# Altium project FPGA_board_controller.PrjPcb (part 1 of 2)
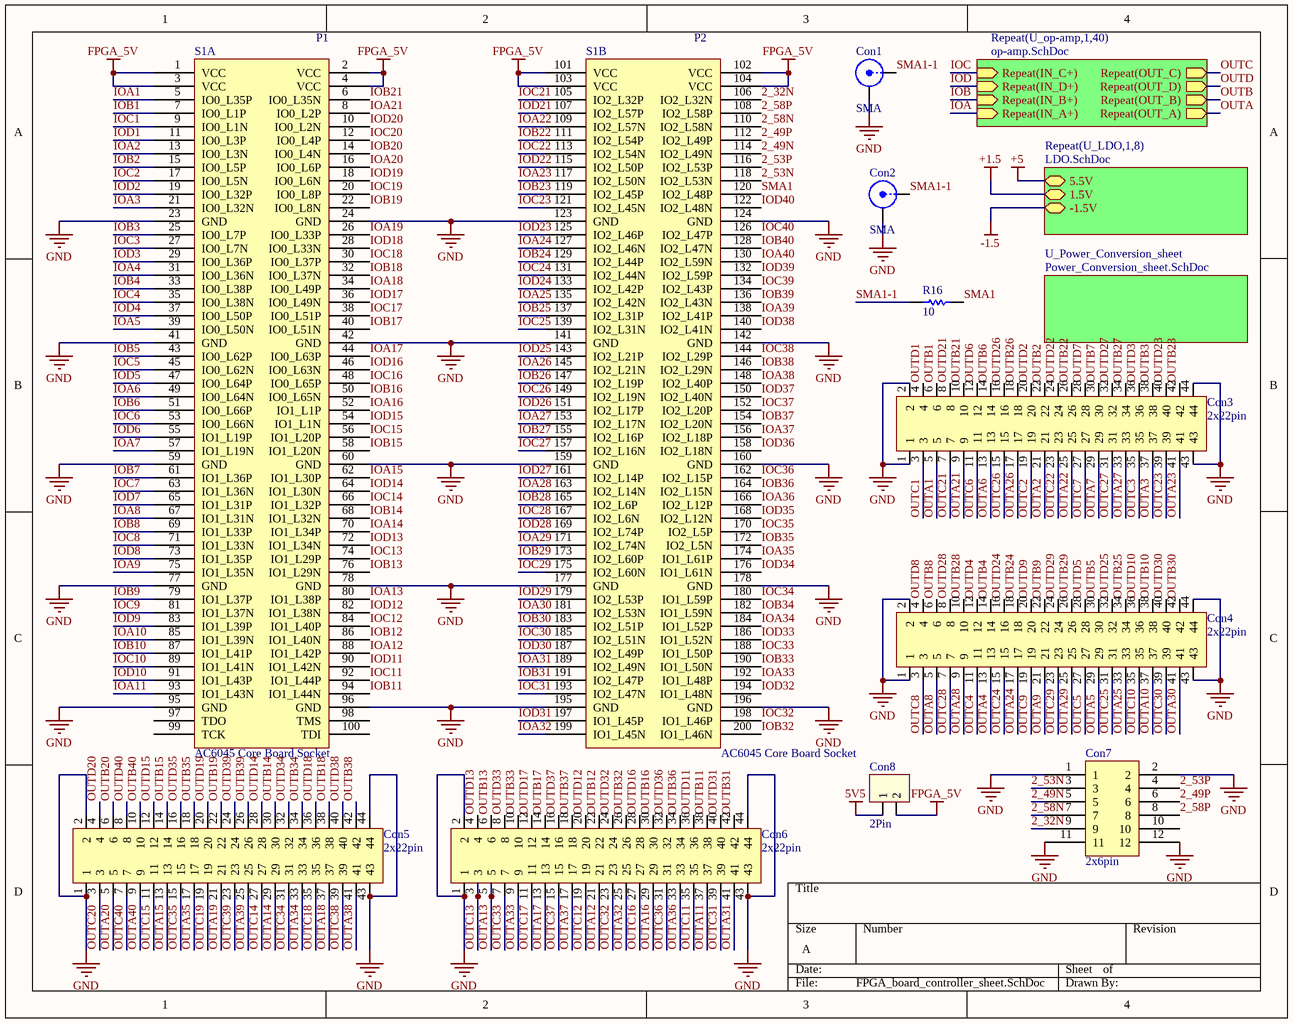
[diagram p0: FPGA_board_controller_sheet.SchDoc]
4 sheets, 507 parts. Net scope: hierarchical (ports join the sheet entries above them; power ports are global).
Board file: PCB1.PcbDoc
Sheets:
  FPGA_board_controller_sheet.SchDoc
    U_Power_Conversion_sheet = Power_Conversion_sheet.SchDoc
    U_LDO1 = LDO.SchDoc
    U_LDO2 = LDO.SchDoc
    U_LDO3 = LDO.SchDoc
    U_LDO4 = LDO.SchDoc
    U_LDO5 = LDO.SchDoc
    U_LDO6 = LDO.SchDoc
    U_LDO7 = LDO.SchDoc
    U_LDO8 = LDO.SchDoc
    U_op-amp1 = op-amp.SchDoc
    U_op-amp2 = op-amp.SchDoc
    U_op-amp3 = op-amp.SchDoc
    U_op-amp4 = op-amp.SchDoc
    U_op-amp5 = op-amp.SchDoc
    U_op-amp6 = op-amp.SchDoc
    U_op-amp7 = op-amp.SchDoc
    U_op-amp8 = op-amp.SchDoc
    U_op-amp9 = op-amp.SchDoc
    U_op-amp10 = op-amp.SchDoc
    U_op-amp11 = op-amp.SchDoc
    U_op-amp12 = op-amp.SchDoc
    U_op-amp13 = op-amp.SchDoc
    U_op-amp14 = op-amp.SchDoc
    U_op-amp15 = op-amp.SchDoc
    U_op-amp16 = op-amp.SchDoc
    U_op-amp17 = op-amp.SchDoc
    U_op-amp18 = op-amp.SchDoc
    U_op-amp19 = op-amp.SchDoc
    U_op-amp20 = op-amp.SchDoc
    U_op-amp21 = op-amp.SchDoc
    U_op-amp22 = op-amp.SchDoc
    U_op-amp23 = op-amp.SchDoc
    U_op-amp24 = op-amp.SchDoc
    U_op-amp25 = op-amp.SchDoc
    U_op-amp26 = op-amp.SchDoc
    U_op-amp27 = op-amp.SchDoc
    U_op-amp28 = op-amp.SchDoc
    U_op-amp29 = op-amp.SchDoc
    U_op-amp30 = op-amp.SchDoc
    U_op-amp31 = op-amp.SchDoc
    U_op-amp32 = op-amp.SchDoc
    U_op-amp33 = op-amp.SchDoc
    U_op-amp34 = op-amp.SchDoc
    U_op-amp35 = op-amp.SchDoc
    U_op-amp36 = op-amp.SchDoc
    U_op-amp37 = op-amp.SchDoc
    U_op-amp38 = op-amp.SchDoc
    U_op-amp39 = op-amp.SchDoc
    U_op-amp40 = op-amp.SchDoc

## Sheet FPGA_board_controller_sheet.SchDoc
size A; SheetNumber: 1; SheetTotal: 4

### Parts
Con1  SMA  [SMA (3.5mm)]
Con2  SMA  [SMA (3.5mm)]
Con3  2x22pin  [2mm_2x22pin]
Con4  2x22pin  [2mm_2x22pin]
Con5  2x22pin  [2mm_2x22pin]
Con6  2x22pin  [2mm_2x22pin]
Con7  2x6pin  [2MM_2*6PIN]
Con8  2Pin  [XH2.54-2pin]
R16  10  [R0603]
S1  AC6045 Core Board Socket  [Core Board Socket]  (parts A,B of 2)

### Sub-sheets
Repeat(U_LDO,1,8) = LDO.SchDoc: 5.5V (bidir), 1.5V (bidir), -1.5V (bidir)
Repeat(U_op-amp,1,40) = op-amp.SchDoc: Repeat(IN_C+) (in), Repeat(OUT_C) (out), Repeat(OUT_D) (out), Repeat(IN_D+) (in), Repeat(OUT_B) (out), Repeat(IN_B+) (in), Repeat(OUT_A) (out), Repeat(IN_A+) (in)
U_Power_Conversion_sheet = Power_Conversion_sheet.SchDoc: no entries

### Nets
5V5: Con8.1
FPGA_5V: Con8.2 S1.1(VCC) S1.2(VCC) S1.3(VCC) S1.4(VCC) S1.101(VCC) S1.102(VCC) S1.103(VCC) S1.104(VCC)
GND: Con1.2(Y) Con2.2(Y) Con3.1 Con3.2 Con3.43 Con3.44 Con4.1 Con4.2 Con4.43 Con4.44 Con5.1 Con5.2 Con5.43 Con5.44 Con6.1 Con6.2 Con6.43 Con6.44 Con7.1 Con7.2 Con7.11 Con7.12 S1.23(GND) S1.24(GND) S1.41(GND) S1.42(GND) S1.59(GND) S1.60(GND) S1.77(GND) S1.78(GND) S1.95(GND) S1.96(GND) S1.123(GND) S1.124(GND) S1.141(GND) S1.142(GND) S1.159(GND) S1.160(GND) S1.177(GND) S1.178(GND) S1.195(GND) S1.196(GND)
2_32N: Con7.9 S1.106(IO2_L32N)
2_49N: Con7.5 S1.114(IO2_L49N)
2_49P: Con7.6 S1.112(IO2_L49P)
2_53N: Con7.3 S1.118(IO2_L53N)
2_53P: Con7.4 S1.116(IO2_L53P)
2_58N: Con7.7 S1.110(IO2_L58N)
2_58P: Con7.8 S1.108(IO2_L58P)
IOA: sheet Repeat(U_op-amp,1,40)/Repeat(IN_A+)
IOA1: S1.5(IO0_L35P)
IOA2: S1.13(IO0_L3N)
IOA3: S1.21(IO0_L32N)
IOA4: S1.31(IO0_L36N)
IOA5: S1.39(IO0_L50N)
IOA6: S1.49(IO0_L64N)
IOA7: S1.57(IO1_L19N)
IOA8: S1.67(IO1_L31N)
IOA9: S1.75(IO1_L35N)
IOA10: S1.85(IO1_L39N)
IOA11: S1.93(IO1_L43N)
IOA12: S1.88(IO1_L42P)
IOA13: S1.80(IO1_L38P)
IOA14: S1.70(IO1_L34P)
IOA15: S1.62(IO1_L30P)
IOA16: S1.52(IO1_L1P)
IOA17: S1.44(IO0_L63P)
IOA18: S1.34(IO0_L49P)
IOA19: S1.26(IO0_L33P)
IOA20: S1.16(IO0_L6P)
IOA21: S1.8(IO0_L2P)
IOA22: S1.109(IO2_L57N)
IOA23: S1.117(IO2_L50N)
IOA24: S1.127(IO2_L46N)
IOA25: S1.135(IO2_L42N)
IOA26: S1.145(IO2_L21N)
IOA27: S1.153(IO2_L17N)
IOA28: S1.163(IO2_L14N)
IOA29: S1.171(IO2_L74N)
IOA30: S1.181(IO2_L53N)
IOA31: S1.189(IO2_L49N)
IOA32: S1.199(IO1_L45N)
IOA33: S1.192(IO1_L48P)
IOA34: S1.184(IO1_L52P)
IOA35: S1.174(IO1_L61P)
IOA36: S1.166(IO2_L12P)
IOA37: S1.156(IO2_L18P)
IOA38: S1.148(IO2_L40P)
IOA39: S1.138(IO2_L41P)
IOA40: S1.130(IO2_L59N)
IOB: sheet Repeat(U_op-amp,1,40)/Repeat(IN_B+)
IOB1: S1.7(IO0_L1P)
IOB2: S1.15(IO0_L5P)
IOB3: S1.25(IO0_L7P)
IOB4: S1.33(IO0_L38P)
IOB5: S1.43(IO0_L62P)
IOB6: S1.51(IO0_L66P)
IOB7: S1.61(IO1_L36P)
IOB8: S1.69(IO1_L33P)
IOB9: S1.79(IO1_L37P)
IOB10: S1.87(IO1_L41P)
IOB11: S1.94(IO1_L44N)
IOB12: S1.86(IO1_L40N)
IOB13: S1.76(IO1_L29N)
IOB14: S1.68(IO1_L32N)
IOB15: S1.58(IO1_L20N)
IOB16: S1.50(IO0_L65N)
IOB17: S1.40(IO0_L51N)
IOB18: S1.32(IO0_L37N)
IOB19: S1.22(IO0_L8N)
IOB20: S1.14(IO0_L4N)
IOB21: S1.6(IO0_L35N)
IOB22: S1.111(IO2_L54P)
IOB23: S1.119(IO2_L45P)
IOB24: S1.129(IO2_L44P)
IOB25: S1.137(IO2_L31P)
IOB26: S1.147(IO2_L19P)
IOB27: S1.155(IO2_L16P)
IOB28: S1.165(IO2_L6P)
IOB29: S1.173(IO2_L60P)
IOB30: S1.183(IO2_L51P)
IOB31: S1.191(IO2_L47P)
IOB32: S1.200(IO1_L46N)
IOB33: S1.190(IO1_L50N)
IOB34: S1.182(IO1_L59N)
IOB35: S1.172(IO2_L5N)
IOB36: S1.164(IO2_L15N)
IOB37: S1.154(IO2_L20N)
IOB38: S1.146(IO2_L29N)
IOB39: S1.136(IO2_L43N)
IOB40: S1.128(IO2_L47N)
IOC: sheet Repeat(U_op-amp,1,40)/Repeat(IN_C+)
IOC1: S1.9(IO0_L1N)
IOC2: S1.17(IO0_L5N)
IOC3: S1.27(IO0_L7N)
IOC4: S1.35(IO0_L38N)
IOC5: S1.45(IO0_L62N)
IOC6: S1.53(IO0_L66N)
IOC7: S1.63(IO1_L36N)
IOC8: S1.71(IO1_L33N)
IOC9: S1.81(IO1_L37N)
IOC10: S1.89(IO1_L41N)
IOC11: S1.92(IO1_L44P)
IOC12: S1.84(IO1_L40P)
IOC13: S1.74(IO1_L29P)
IOC14: S1.66(IO1_L32P)
IOC15: S1.56(IO1_L20P)
IOC16: S1.48(IO0_L65P)
IOC17: S1.38(IO0_L51P)
IOC18: S1.30(IO0_L37P)
IOC19: S1.20(IO0_L8P)
IOC20: S1.12(IO0_L4P)
IOC21: S1.105(IO2_L32P)
IOC22: S1.113(IO2_L54N)
IOC23: S1.121(IO2_L45N)
IOC24: S1.131(IO2_L44N)
IOC25: S1.139(IO2_L31N)
IOC26: S1.149(IO2_L19N)
IOC27: S1.157(IO2_L16N)
IOC28: S1.167(IO2_L6N)
IOC29: S1.175(IO2_L60N)
IOC30: S1.185(IO2_L51N)
IOC31: S1.193(IO2_L47N)
IOC32: S1.198(IO1_L46P)
IOC33: S1.188(IO1_L50P)
IOC34: S1.180(IO1_L59P)
IOC35: S1.170(IO2_L5P)
IOC36: S1.162(IO2_L15P)
IOC37: S1.152(IO2_L20P)
IOC38: S1.144(IO2_L29P)
IOC39: S1.134(IO2_L43P)
IOC40: S1.126(IO2_L47P)
IOD: sheet Repeat(U_op-amp,1,40)/Repeat(IN_D+)
IOD1: S1.11(IO0_L3P)
IOD2: S1.19(IO0_L32P)
IOD3: S1.29(IO0_L36P)
IOD4: S1.37(IO0_L50P)
IOD5: S1.47(IO0_L64P)
IOD6: S1.55(IO1_L19P)
IOD7: S1.65(IO1_L31P)
IOD8: S1.73(IO1_L35P)
IOD9: S1.83(IO1_L39P)
IOD10: S1.91(IO1_L43P)
IOD11: S1.90(IO1_L42N)
IOD12: S1.82(IO1_L38N)
IOD13: S1.72(IO1_L34N)
IOD14: S1.64(IO1_L30N)
IOD15: S1.54(IO1_L1N)
IOD16: S1.46(IO0_L63N)
IOD17: S1.36(IO0_L49N)
IOD18: S1.28(IO0_L33N)
IOD19: S1.18(IO0_L6N)
IOD20: S1.10(IO0_L2N)
IOD21: S1.107(IO2_L57P)
IOD22: S1.115(IO2_L50P)
IOD23: S1.125(IO2_L46P)
IOD24: S1.133(IO2_L42P)
IOD25: S1.143(IO2_L21P)
IOD26: S1.151(IO2_L17P)
IOD27: S1.161(IO2_L14P)
IOD28: S1.169(IO2_L74P)
IOD29: S1.179(IO2_L53P)
IOD30: S1.187(IO2_L49P)
IOD31: S1.197(IO1_L45P)
IOD32: S1.194(IO1_L48N)
IOD33: S1.186(IO1_L52N)
IOD34: S1.176(IO1_L61N)
IOD35: S1.168(IO2_L12N)
IOD36: S1.158(IO2_L18N)
IOD37: S1.150(IO2_L40N)
IOD38: S1.140(IO2_L41N)
IOD39: S1.132(IO2_L59P)
IOD40: S1.122(IO2_L48N)
OUTA: sheet Repeat(U_op-amp,1,40)/Repeat(OUT_A)
OUTA1: Con3.5
OUTA2: Con3.21
OUTA3: Con3.37
OUTA4: Con4.13
OUTA5: Con4.29
OUTA6: Con3.13
OUTA7: Con3.29
OUTA8: Con4.5
OUTA9: Con4.21
OUTA10: Con4.37
OUTA11: Con6.37
OUTA12: Con6.21
OUTA13: Con6.5
OUTA14: Con5.29
OUTA15: Con5.13
OUTA16: Con6.29
OUTA17: Con6.13
OUTA18: Con5.37
OUTA19: Con5.21
OUTA20: Con5.5
OUTA21: Con3.9
OUTA22: Con3.25
OUTA23: Con3.41
OUTA24: Con4.17
OUTA25: Con4.33
OUTA26: Con3.17
OUTA27: Con3.33
OUTA28: Con4.9
OUTA29: Con4.25
OUTA30: Con4.41
OUTA31: Con6.41
OUTA32: Con6.25
OUTA33: Con6.9
OUTA34: Con5.33
OUTA35: Con5.17
OUTA36: Con6.33
OUTA37: Con6.17
OUTA38: Con5.41
OUTA39: Con5.25
OUTA40: Con5.9
OUTB: sheet Repeat(U_op-amp,1,40)/Repeat(OUT_B)
OUTB1: Con3.6
OUTB2: Con3.22
OUTB3: Con3.38
OUTB4: Con4.14
OUTB5: Con4.30
OUTB6: Con3.14
OUTB7: Con3.30
OUTB8: Con4.6
OUTB9: Con4.22
OUTB10: Con4.38
OUTB11: Con6.38
OUTB12: Con6.22
OUTB13: Con6.6
OUTB14: Con5.30
OUTB15: Con5.14
OUTB16: Con6.30
OUTB17: Con6.14
OUTB18: Con5.38
OUTB19: Con5.22
OUTB20: Con5.6
OUTB21: Con3.10
OUTB22: Con3.26
OUTB23: Con3.42
OUTB24: Con4.18
OUTB25: Con4.34
OUTB26: Con3.18
OUTB27: Con3.34
OUTB28: Con4.10
OUTB29: Con4.26
OUTB30: Con4.42
OUTB31: Con6.42
OUTB32: Con6.26
OUTB33: Con6.10
OUTB34: Con5.34
OUTB35: Con5.18
OUTB36: Con6.34
OUTB37: Con6.18
OUTB38: Con5.42
OUTB39: Con5.26
OUTB40: Con5.10
OUTC: sheet Repeat(U_op-amp,1,40)/Repeat(OUT_C)
OUTC1: Con3.3
OUTC2: Con3.19
OUTC3: Con3.35
OUTC4: Con4.11
OUTC5: Con4.27
OUTC6: Con3.11
OUTC7: Con3.27
OUTC8: Con4.3
OUTC9: Con4.19
OUTC10: Con4.35
OUTC11: Con6.35
OUTC12: Con6.19
OUTC13: Con6.3
OUTC14: Con5.27
OUTC15: Con5.11
OUTC16: Con6.27
OUTC17: Con6.11
OUTC18: Con5.35
OUTC19: Con5.19
OUTC20: Con5.3
OUTC21: Con3.7
OUTC22: Con3.23
OUTC23: Con3.39
OUTC24: Con4.15
OUTC25: Con4.31
OUTC26: Con3.15
OUTC27: Con3.31
OUTC28: Con4.7
OUTC29: Con4.23
OUTC30: Con4.39
OUTC31: Con6.39
OUTC32: Con6.23
OUTC33: Con6.7
OUTC34: Con5.31
OUTC35: Con5.15
OUTC36: Con6.31
OUTC37: Con6.15
OUTC38: Con5.39
OUTC39: Con5.23
OUTC40: Con5.7
OUTD: sheet Repeat(U_op-amp,1,40)/Repeat(OUT_D)
OUTD1: Con3.4
OUTD2: Con3.20
OUTD3: Con3.36
OUTD4: Con4.12
OUTD5: Con4.28
OUTD6: Con3.12
OUTD7: Con3.28
OUTD8: Con4.4
OUTD9: Con4.20
OUTD10: Con4.36
OUTD11: Con6.36
OUTD12: Con6.20
OUTD13: Con6.4
OUTD14: Con5.28
OUTD15: Con5.12
OUTD16: Con6.28
OUTD17: Con6.12
OUTD18: Con5.36
OUTD19: Con5.20
OUTD20: Con5.4
OUTD21: Con3.8
OUTD22: Con3.24
OUTD23: Con3.40
OUTD24: Con4.16
OUTD25: Con4.32
OUTD26: Con3.16
OUTD27: Con3.32
OUTD28: Con4.8
OUTD29: Con4.24
OUTD30: Con4.40
OUTD31: Con6.40
OUTD32: Con6.24
OUTD33: Con6.8
OUTD34: Con5.32
OUTD35: Con5.16
OUTD36: Con6.32
OUTD37: Con6.16
OUTD38: Con5.40
OUTD39: Con5.24
OUTD40: Con5.8
SMA1: R16.2 S1.120(IO2_L48P)
SMA1-1: Con1.1(X) Con2.1(X) R16.1

Not connected (* = marked no-connect by the designer): Con7 10; S1 97(TDO) 98(TMS) 99(TCK) 100(TDI)

### Notes on the sheet
- (in symbol AC6045 Core Board Socket, part A) P1
- (in symbol AC6045 Core Board Socket, part B) P2

### Library data of the parts
R16 = Resistor: value: *

## Sheet Power_Conversion_sheet.SchDoc
size A; SheetNumber: 2; SheetTotal: 4
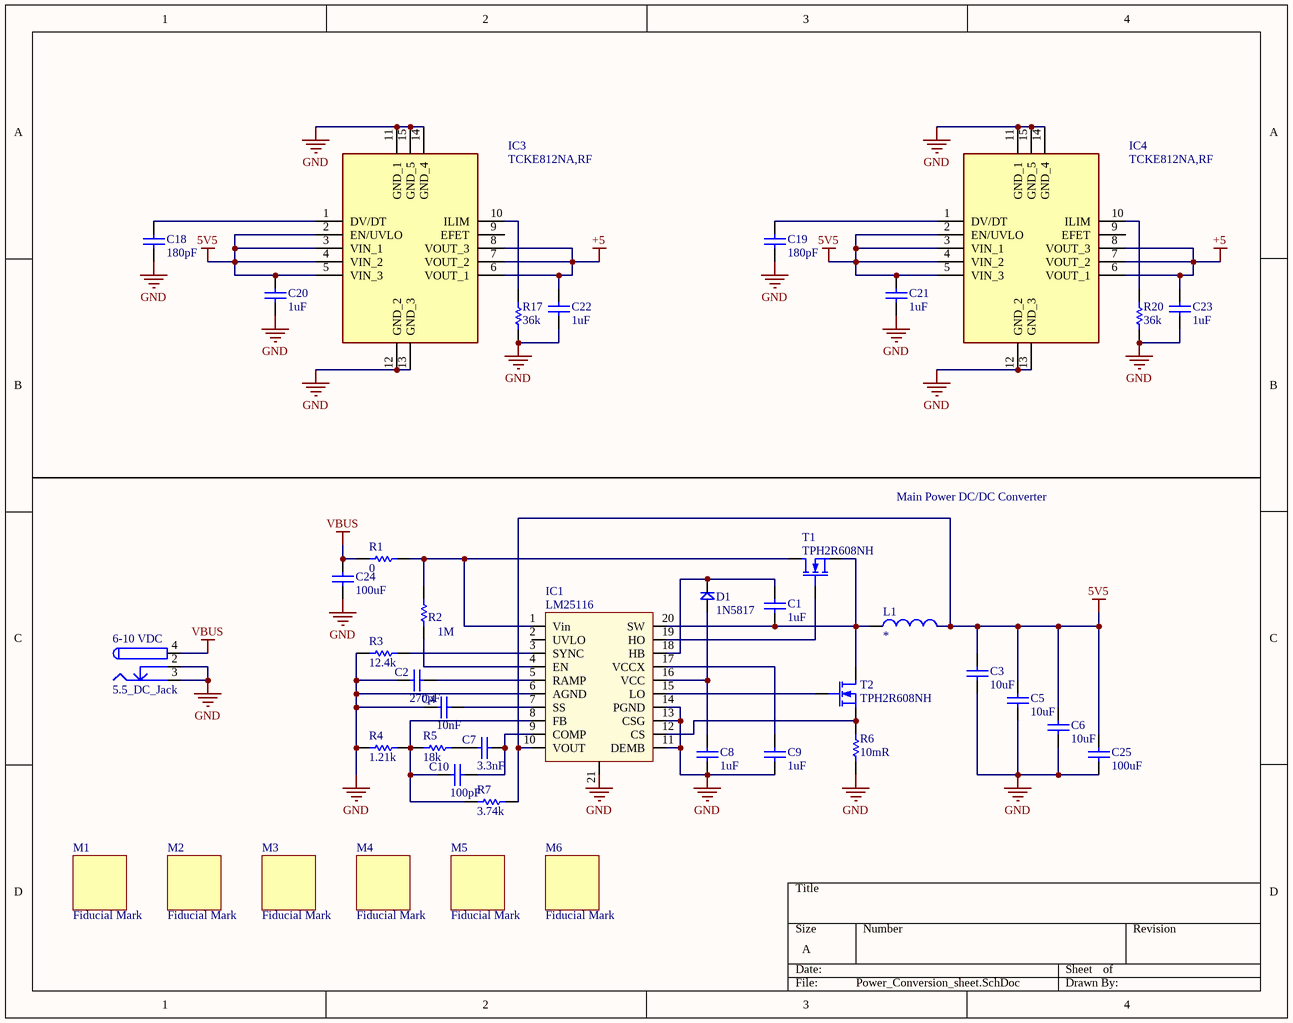
[diagram p1: Power_Conversion_sheet.SchDoc]

### Parts
6-10_VDC  5.5_DC_Jack  [5.5_DC_Jack]
C1  1uF  [C0603]
C2  270pF  [C0603]
C3  10uF  [C0603]
C4  10nF  [C0603]
C5  10uF  [C0603]
C6  10uF  [C0603]
C7  3.3nF  [C0603]
C8  1uF  [C0603]
C9  1uF  [C0603]
C10  100pF  [C0603]
C18  180pF  [C0603]
C19  180pF  [C0603]
C20  1uF  [C0603]
C21  1uF  [C0603]
C22  1uF  [C0603]
C23  1uF  [C0603]
C24  100uF  [C1206]
C25  100uF  [C1206]
D1  1N5817  [Diode-SOD-323]
IC1  LM25116  [HTSSOP-20]
IC3  TCKE812NA,RF  [TCKE812NARF]
IC4  TCKE812NA,RF  [TCKE812NARF]
L1  *  [Inductor-CDEP147]
M1  Fiducial Mark  [fiducial mark]
M2  Fiducial Mark  [fiducial mark]
M3  Fiducial Mark  [fiducial mark]
M4  Fiducial Mark  [fiducial mark]
M5  Fiducial Mark  [fiducial mark]
M6  Fiducial Mark  [fiducial mark]
R1  0  [R2010]
R2  1M  [R0603]
R3  12.4k  [R0603]
R4  1.21k  [R0603]
R5  18k  [R0603]
R6  10mR  [R2010]
R7  3.74k  [R0603]
R17  36k  [R0603]
R20  36k  [R0603]
T1  TPH2R608NH  [TPH2R608NH]
T2  TPH2R608NH  [TPH2R608NH]

### Nets
5V5: C3.2 C5.2 C6.2 C20.2 C21.2 C25.2 IC1.10(VOUT) IC3.2(EN/UVLO) IC3.3(VIN_1) IC3.4(VIN_2) IC3.5(VIN_3) IC4.2(EN/UVLO) IC4.3(VIN_1) IC4.4(VIN_2) IC4.5(VIN_3) L1.2 R7.2
+5: C22.2 C23.2 IC3.6(VOUT_1) IC3.7(VOUT_2) IC3.8(VOUT_3) IC4.6(VOUT_1) IC4.7(VOUT_2) IC4.8(VOUT_3)
GND: 6-10_VDC.2 6-10_VDC.3 C2.1 C3.1 C4.1 C5.1 C6.1 C8.1 C9.1 C18.1 C19.1 C20.1 C21.1 C22.1 C23.1 C24.1 C25.1 IC1.6(AGND) IC1.11(DEMB) IC1.13(CSG) IC1.14(PGND) IC1.21 IC3.11(GND_1) IC3.12(GND_2) IC3.13(GND_3) IC3.14(GND_4) IC3.15(GND_5) IC4.11(GND_1) IC4.12(GND_2) IC4.13(GND_3) IC4.14(GND_4) IC4.15(GND_5) R3.1 R4.1 R6.1 R17.1 R20.1
VBUS: 6-10_VDC.4 C24.2 R1.1
NetC1_1: C1.1 IC1.20(SW) L1.1 T1.3(S) T2.1(D)
NetC1_2: C1.2 D1.2(KATHODE) IC1.18(HB)
NetC2_2: C2.2 IC1.5(RAMP)
NetC4_2: C4.2 IC1.7(SS)
NetC7_1: C7.1 R5.1
NetC7_2: C7.2 C10.2 IC1.9(COMP)
NetC8_2: C8.2 D1.1(ANODE) IC1.16(VCC)
NetC9_2: C9.2 IC1.17(VCCX)
NetC10_1: C10.1 IC1.8(FB) R4.2 R5.2 R7.1
NetC18_2: C18.2 IC3.1(DV/DT)
NetC19_2: C19.2 IC4.1(DV/DT)
NetIC1_1: IC1.1(Vin) R1.2 R2.1 T1.1(D)
NetIC1_3: IC1.3(SYNC) R3.2
NetIC1_4: IC1.4(EN) R2.2
NetIC1_12: IC1.12(CS) R6.2 T2.3(S)
NetIC1_15: IC1.15(LO) T2.2(G)
NetIC1_19: IC1.19(HO) T1.2(G)
NetIC3_10: IC3.10(ILIM) R17.2
NetIC4_10: IC4.10(ILIM) R20.2

Not connected (* = marked no-connect by the designer): IC1 2(UVLO); IC3 9(EFET); IC4 9(EFET)

### Notes on the sheet
- Main Power DC/DC Converter

### Library data of the parts
C1-C10 C18-C25 = Cap
  C1 C8 C9: value: 1uF
  C2: value: 270pF
  C3 C5 C6: value: 10uF
  C4: value: 10nF
  C7: value: 3.3nF
  C10: value: 100pF
  C18-C23: value: *
  C24 C25: value: 100uF
D1 = Diode
IC1 = LM25116: Buck Controller
IC3 IC4 = TCKE812NA,RF: Integrated Circuit; Manufacturer_Name: Toshiba; Datasheet Link: https://www.arrow.com/en/products/tcke812narf/toshiba; Height: 0.75mm; Manufacturer_Part_Number: TCKE812NA,RF; Mouser Part Number: 757-TCKE812NA,RF; Mouser Price/Stock: https://www.mouser.co.uk/ProductDetail/Toshiba/TCKE812NARF?qs=7MVldsJ5UazIz%2F5VEH%2F60g%3D%3D; Arrow Part Number: TCKE812NA,RF; Arrow Price/Stock: https://www.arrow.com/en/products/tcke812narf/toshiba
L1 = Inductor: value: *
R1-R7 = Resistor
  R1: value: 0
  R2: value: 1M
  R3: value: 12.4k
  R4: value: 1.21k
  R5: value: 18k
  R6: value: 10mR
  R7: value: 3.74k
R17 R20 = Resistor: The current limit is in 3A.; value: *
T1 T2 = MOSFET-N

## Sheet LDO.SchDoc
size A; SheetNumber: 4; SheetTotal: 4
Used 8 times, as channels U_LDO1, U_LDO2, U_LDO3, U_LDO4, U_LDO5, U_LDO6, U_LDO7, U_LDO8. Parts and nets are listed once, with the designators drawn on the sheet.
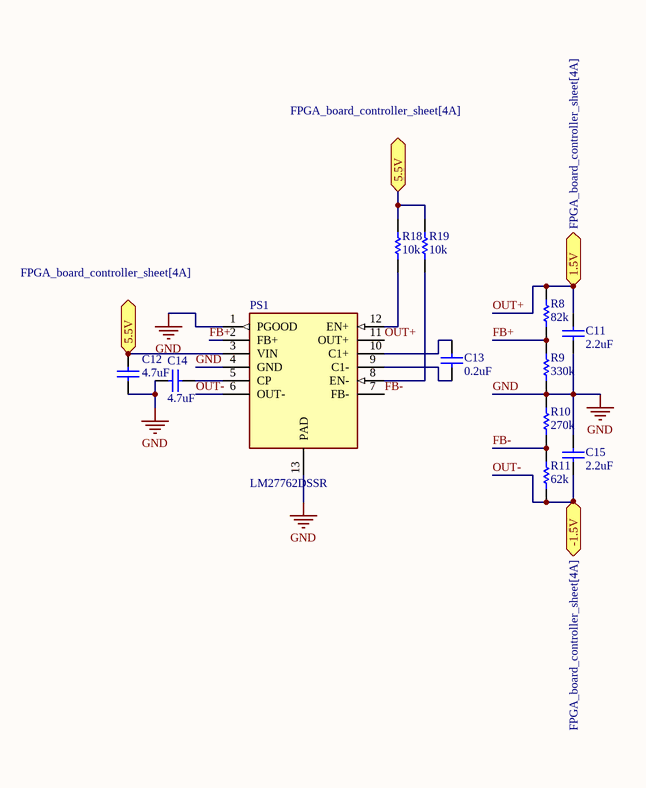
[diagram p2: LDO.SchDoc]

### Parts
C11  2.2uF  [C0603]
C12  4.7uF  [C0603]
C13  0.2uF  [C0603]
C14  4.7uF  [C0603]
C15  2.2uF  [C0603]
PS1  LM27762DSSR  [SON50P200X300X80-13N-D]
R8  82k  [R0603]
R9  330k  [R0603]
R10  270k  [R0603]
R11  62k  [R0603]
R18  10k  [R0603]
R19  10k  [R0603]

### Ports
1.5V (bidir, see FPGA_board_controller_sheet[4A]), 5.5V (bidir, see FPGA_board_controller_sheet[4A]), -1.5V (bidir, see FPGA_board_controller_sheet[4A])

### Nets
GND: C11.1 C12.1 C14.1 C15.2 PS1.1(PGOOD) PS1.4(GND) PS1.13(PAD) R9.1 R10.2
5.5V: C12.2 PS1.3(VIN) R18.2 R19.2 ; port 5.5V
FB+: PS1.2(FB+) R8.1 R9.2
FB-: PS1.7(FB-) R10.1 R11.2
OUT+: C11.2 PS1.11(OUT+) R8.2 ; port 1.5V
OUT-: C15.1 PS1.6(OUT-) R11.1 ; port -1.5V
NetC13_1: C13.1 PS1.9(C1-)
NetC13_2: C13.2 PS1.10(C1+)
NetC14_2: C14.2 PS1.5(CP)
NetPS1_8: PS1.8(EN-) R19.1
NetPS1_12: PS1.12(EN+) R18.1

### Channels
U_LDO1: designators end in _1; ports 1.5V=OUT+ 5.5V=+5 -1.5V=OUT-
U_LDO2: designators end in _2; ports 1.5V=OUT+ 5.5V=+5 -1.5V=OUT-
U_LDO3: designators end in _3; ports 1.5V=OUT+ 5.5V=+5 -1.5V=OUT-
U_LDO4: designators end in _4; ports 1.5V=OUT+ 5.5V=+5 -1.5V=OUT-
U_LDO5: designators end in _5; ports 1.5V=OUT+ 5.5V=+5 -1.5V=OUT-
U_LDO6: designators end in _6; ports 1.5V=OUT+ 5.5V=+5 -1.5V=OUT-
U_LDO7: designators end in _7; ports 1.5V=OUT+ 5.5V=+5 -1.5V=OUT-
U_LDO8: designators end in _8; ports 1.5V=OUT+ 5.5V=+5 -1.5V=OUT-

### Library data of the parts
C11-C15 = Cap: value: *
PS1 = LM27762DSSR: Power Supply; Manufacturer_Name: Texas Instruments; Datasheet Link: https://www.ti.com/lit/ds/symlink/lm27762.pdf; Height: 0.8mm; Manufacturer_Part_Number: LM27762DSSR; Mouser Part Number: 595-LM27762DSSR; Mouser Price/Stock: https://www.mouser.co.uk/ProductDetail/Texas-Instruments/LM27762DSSR?qs=vcbl%252BK4rRlfEJcC9xQ80sA%3D%3D; Arrow Part Number: LM27762DSSR; Arrow Price/Stock: https://www.arrow.com/en/products/lm27762dssr/texas-instruments?region=nac
R8-R11 R18 R19 = Resistor: value: *

## Sheet op-amp.SchDoc
size A; SheetNumber: 3; SheetTotal: 4
Used 40 times, as channels U_op-amp1, U_op-amp2, U_op-amp3, U_op-amp4, U_op-amp5, U_op-amp6, U_op-amp7, U_op-amp8, U_op-amp9, U_op-amp10, U_op-amp11, U_op-amp12, U_op-amp13, U_op-amp14, U_op-amp15, U_op-amp16, U_op-amp17, U_op-amp18, U_op-amp19, U_op-amp20, U_op-amp21, U_op-amp22, U_op-amp23, U_op-amp24, U_op-amp25, U_op-amp26, U_op-amp27, U_op-amp28, U_op-amp29, U_op-amp30, U_op-amp31, U_op-amp32, U_op-amp33, U_op-amp34, U_op-amp35, U_op-amp36, U_op-amp37, U_op-amp38, U_op-amp39, U_op-amp40. Parts and nets are listed once, with the designators drawn on the sheet.
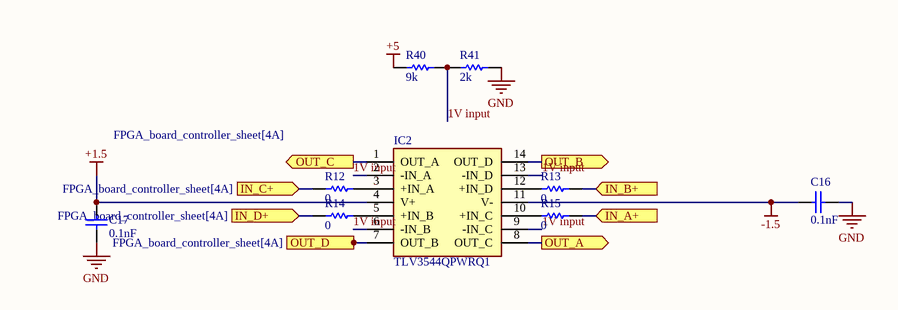
[diagram p3: op-amp.SchDoc]

### Parts
C16  0.1nF  [C0603]
C17  0.1nF  [C0603]
IC2  TLV3544QPWRQ1  [SOP65P640X120-14N]
R12  0  [R0603]
R13  0  [R0603]
R14  0  [R0603]
R15  0  [R0603]
R40  9k  [R0603]
R41  2k  [R0603]

### Ports
IN_A+ (in, see FPGA_board_controller_sheet[4A]), IN_B+ (in, see FPGA_board_controller_sheet[4A]), IN_C+ (in, see FPGA_board_controller_sheet[4A]), IN_D+ (in, see FPGA_board_controller_sheet[4A]), OUT_A (out, see FPGA_board_controller_sheet[4A]), OUT_B (out, see FPGA_board_controller_sheet[4A]), OUT_C (out, see FPGA_board_controller_sheet[4A]), OUT_D (out, see FPGA_board_controller_sheet[4A])

### Nets
+1.5: C17.2 IC2.4(V+)
+5: R40.1
-1.5: C16.1 IC2.11(V-)
GND: C16.2 C17.1 R41.2
1V input: IC2.2(-IN_A) IC2.6(-IN_B) IC2.9(-IN_C) IC2.13(-IN_D) R40.2 R41.1
IN_A+: R15.2 ; port IN_A+
IN_B+: R13.2 ; port IN_B+
IN_C+: R12.1 ; port IN_C+
IN_D+: R14.1 ; port IN_D+
OUT_A: IC2.8(OUT_C) ; port OUT_A
OUT_B: IC2.14(OUT_D) ; port OUT_B
OUT_C: IC2.1(OUT_A) ; port OUT_C
OUT_D: IC2.7(OUT_B) ; port OUT_D
NetIC2_3: IC2.3(+IN_A) R12.2
NetIC2_5: IC2.5(+IN_B) R14.2
NetIC2_10: IC2.10(+IN_C) R15.1
NetIC2_12: IC2.12(+IN_D) R13.1

### Channels
U_op-amp1: designators end in _1; ports IN_A+=IOA1 IN_B+=IOB1 IN_C+=IOC1 IN_D+=IOD1 OUT_A=OUTA1 OUT_B=OUTB1 OUT_C=OUTC1 OUT_D=OUTD1
U_op-amp2: designators end in _2; ports IN_A+=IOA2 IN_B+=IOB2 IN_C+=IOC2 IN_D+=IOD2 OUT_A=OUTA2 OUT_B=OUTB2 OUT_C=OUTC2 OUT_D=OUTD2
U_op-amp3: designators end in _3; ports IN_A+=IOA3 IN_B+=IOB3 IN_C+=IOC3 IN_D+=IOD3 OUT_A=OUTA3 OUT_B=OUTB3 OUT_C=OUTC3 OUT_D=OUTD3
U_op-amp4: designators end in _4; ports IN_A+=IOA4 IN_B+=IOB4 IN_C+=IOC4 IN_D+=IOD4 OUT_A=OUTA4 OUT_B=OUTB4 OUT_C=OUTC4 OUT_D=OUTD4
U_op-amp5: designators end in _5; ports IN_A+=IOA5 IN_B+=IOB5 IN_C+=IOC5 IN_D+=IOD5 OUT_A=OUTA5 OUT_B=OUTB5 OUT_C=OUTC5 OUT_D=OUTD5
U_op-amp6: designators end in _6; ports IN_A+=IOA6 IN_B+=IOB6 IN_C+=IOC6 IN_D+=IOD6 OUT_A=OUTA6 OUT_B=OUTB6 OUT_C=OUTC6 OUT_D=OUTD6
U_op-amp7: designators end in _7; ports IN_A+=IOA7 IN_B+=IOB7 IN_C+=IOC7 IN_D+=IOD7 OUT_A=OUTA7 OUT_B=OUTB7 OUT_C=OUTC7 OUT_D=OUTD7
U_op-amp8: designators end in _8; ports IN_A+=IOA8 IN_B+=IOB8 IN_C+=IOC8 IN_D+=IOD8 OUT_A=OUTA8 OUT_B=OUTB8 OUT_C=OUTC8 OUT_D=OUTD8
U_op-amp9: designators end in _9; ports IN_A+=IOA9 IN_B+=IOB9 IN_C+=IOC9 IN_D+=IOD9 OUT_A=OUTA9 OUT_B=OUTB9 OUT_C=OUTC9 OUT_D=OUTD9
U_op-amp10: designators end in _10; ports IN_A+=IOA10 IN_B+=IOB10 IN_C+=IOC10 IN_D+=IOD10 OUT_A=OUTA10 OUT_B=OUTB10 OUT_C=OUTC10 OUT_D=OUTD10
U_op-amp11: designators end in _11; ports IN_A+=IOA11 IN_B+=IOB11 IN_C+=IOC11 IN_D+=IOD11 OUT_A=OUTA11 OUT_B=OUTB11 OUT_C=OUTC11 OUT_D=OUTD11
U_op-amp12: designators end in _12; ports IN_A+=IOA12 IN_B+=IOB12 IN_C+=IOC12 IN_D+=IOD12 OUT_A=OUTA12 OUT_B=OUTB12 OUT_C=OUTC12 OUT_D=OUTD12
U_op-amp13: designators end in _13; ports IN_A+=IOA13 IN_B+=IOB13 IN_C+=IOC13 IN_D+=IOD13 OUT_A=OUTA13 OUT_B=OUTB13 OUT_C=OUTC13 OUT_D=OUTD13
U_op-amp14: designators end in _14; ports IN_A+=IOA14 IN_B+=IOB14 IN_C+=IOC14 IN_D+=IOD14 OUT_A=OUTA14 OUT_B=OUTB14 OUT_C=OUTC14 OUT_D=OUTD14
U_op-amp15: designators end in _15; ports IN_A+=IOA15 IN_B+=IOB15 IN_C+=IOC15 IN_D+=IOD15 OUT_A=OUTA15 OUT_B=OUTB15 OUT_C=OUTC15 OUT_D=OUTD15
U_op-amp16: designators end in _16; ports IN_A+=IOA16 IN_B+=IOB16 IN_C+=IOC16 IN_D+=IOD16 OUT_A=OUTA16 OUT_B=OUTB16 OUT_C=OUTC16 OUT_D=OUTD16
U_op-amp17: designators end in _17; ports IN_A+=IOA17 IN_B+=IOB17 IN_C+=IOC17 IN_D+=IOD17 OUT_A=OUTA17 OUT_B=OUTB17 OUT_C=OUTC17 OUT_D=OUTD17
U_op-amp18: designators end in _18; ports IN_A+=IOA18 IN_B+=IOB18 IN_C+=IOC18 IN_D+=IOD18 OUT_A=OUTA18 OUT_B=OUTB18 OUT_C=OUTC18 OUT_D=OUTD18
U_op-amp19: designators end in _19; ports IN_A+=IOA19 IN_B+=IOB19 IN_C+=IOC19 IN_D+=IOD19 OUT_A=OUTA19 OUT_B=OUTB19 OUT_C=OUTC19 OUT_D=OUTD19
U_op-amp20: designators end in _20; ports IN_A+=IOA20 IN_B+=IOB20 IN_C+=IOC20 IN_D+=IOD20 OUT_A=OUTA20 OUT_B=OUTB20 OUT_C=OUTC20 OUT_D=OUTD20
U_op-amp21: designators end in _21; ports IN_A+=IOA21 IN_B+=IOB21 IN_C+=IOC21 IN_D+=IOD21 OUT_A=OUTA21 OUT_B=OUTB21 OUT_C=OUTC21 OUT_D=OUTD21
U_op-amp22: designators end in _22; ports IN_A+=IOA22 IN_B+=IOB22 IN_C+=IOC22 IN_D+=IOD22 OUT_A=OUTA22 OUT_B=OUTB22 OUT_C=OUTC22 OUT_D=OUTD22
U_op-amp23: designators end in _23; ports IN_A+=IOA23 IN_B+=IOB23 IN_C+=IOC23 IN_D+=IOD23 OUT_A=OUTA23 OUT_B=OUTB23 OUT_C=OUTC23 OUT_D=OUTD23
U_op-amp24: designators end in _24; ports IN_A+=IOA24 IN_B+=IOB24 IN_C+=IOC24 IN_D+=IOD24 OUT_A=OUTA24 OUT_B=OUTB24 OUT_C=OUTC24 OUT_D=OUTD24
U_op-amp25: designators end in _25; ports IN_A+=IOA25 IN_B+=IOB25 IN_C+=IOC25 IN_D+=IOD25 OUT_A=OUTA25 OUT_B=OUTB25 OUT_C=OUTC25 OUT_D=OUTD25
U_op-amp26: designators end in _26; ports IN_A+=IOA26 IN_B+=IOB26 IN_C+=IOC26 IN_D+=IOD26 OUT_A=OUTA26 OUT_B=OUTB26 OUT_C=OUTC26 OUT_D=OUTD26
U_op-amp27: designators end in _27; ports IN_A+=IOA27 IN_B+=IOB27 IN_C+=IOC27 IN_D+=IOD27 OUT_A=OUTA27 OUT_B=OUTB27 OUT_C=OUTC27 OUT_D=OUTD27
U_op-amp28: designators end in _28; ports IN_A+=IOA28 IN_B+=IOB28 IN_C+=IOC28 IN_D+=IOD28 OUT_A=OUTA28 OUT_B=OUTB28 OUT_C=OUTC28 OUT_D=OUTD28
U_op-amp29: designators end in _29; ports IN_A+=IOA29 IN_B+=IOB29 IN_C+=IOC29 IN_D+=IOD29 OUT_A=OUTA29 OUT_B=OUTB29 OUT_C=OUTC29 OUT_D=OUTD29
U_op-amp30: designators end in _30; ports IN_A+=IOA30 IN_B+=IOB30 IN_C+=IOC30 IN_D+=IOD30 OUT_A=OUTA30 OUT_B=OUTB30 OUT_C=OUTC30 OUT_D=OUTD30
U_op-amp31: designators end in _31; ports IN_A+=IOA31 IN_B+=IOB31 IN_C+=IOC31 IN_D+=IOD31 OUT_A=OUTA31 OUT_B=OUTB31 OUT_C=OUTC31 OUT_D=OUTD31
U_op-amp32: designators end in _32; ports IN_A+=IOA32 IN_B+=IOB32 IN_C+=IOC32 IN_D+=IOD32 OUT_A=OUTA32 OUT_B=OUTB32 OUT_C=OUTC32 OUT_D=OUTD32
U_op-amp33: designators end in _33; ports IN_A+=IOA33 IN_B+=IOB33 IN_C+=IOC33 IN_D+=IOD33 OUT_A=OUTA33 OUT_B=OUTB33 OUT_C=OUTC33 OUT_D=OUTD33
U_op-amp34: designators end in _34; ports IN_A+=IOA34 IN_B+=IOB34 IN_C+=IOC34 IN_D+=IOD34 OUT_A=OUTA34 OUT_B=OUTB34 OUT_C=OUTC34 OUT_D=OUTD34
U_op-amp35: designators end in _35; ports IN_A+=IOA35 IN_B+=IOB35 IN_C+=IOC35 IN_D+=IOD35 OUT_A=OUTA35 OUT_B=OUTB35 OUT_C=OUTC35 OUT_D=OUTD35
U_op-amp36: designators end in _36; ports IN_A+=IOA36 IN_B+=IOB36 IN_C+=IOC36 IN_D+=IOD36 OUT_A=OUTA36 OUT_B=OUTB36 OUT_C=OUTC36 OUT_D=OUTD36
U_op-amp37: designators end in _37; ports IN_A+=IOA37 IN_B+=IOB37 IN_C+=IOC37 IN_D+=IOD37 OUT_A=OUTA37 OUT_B=OUTB37 OUT_C=OUTC37 OUT_D=OUTD37
U_op-amp38: designators end in _38; ports IN_A+=IOA38 IN_B+=IOB38 IN_C+=IOC38 IN_D+=IOD38 OUT_A=OUTA38 OUT_B=OUTB38 OUT_C=OUTC38 OUT_D=OUTD38
U_op-amp39: designators end in _39; ports IN_A+=IOA39 IN_B+=IOB39 IN_C+=IOC39 IN_D+=IOD39 OUT_A=OUTA39 OUT_B=OUTB39 OUT_C=OUTC39 OUT_D=OUTD39
U_op-amp40: designators end in _40; ports IN_A+=IOA40 IN_B+=IOB40 IN_C+=IOC40 IN_D+=IOD40 OUT_A=OUTA40 OUT_B=OUTB40 OUT_C=OUTC40 OUT_D=OUTD40

### Library data of the parts
C16 C17 = Cap: value: *
IC2 = TLV3544QPWRQ1: Integrated Circuit; Manufacturer_Name: Texas Instruments; Datasheet Link: http://www.ti.com/lit/gpn/tlv3544-q1; Height: 1.2mm; Manufacturer_Part_Number: TLV3544QPWRQ1; Mouser Part Number: 595-TLV3544QPWRQ1; Mouser Price/Stock: https://www.mouser.co.uk/ProductDetail/Texas-Instruments/TLV3544QPWRQ1?qs=xhbEVWpZdWeZ7jRiLWDiEw%3D%3D; Arrow Part Number: TLV3544QPWRQ1; Arrow Price/Stock: https://www.arrow.com/en/products/tlv3544qpwrq1/texas-instruments
R12-R15 R40 R41 = Resistor: value: *